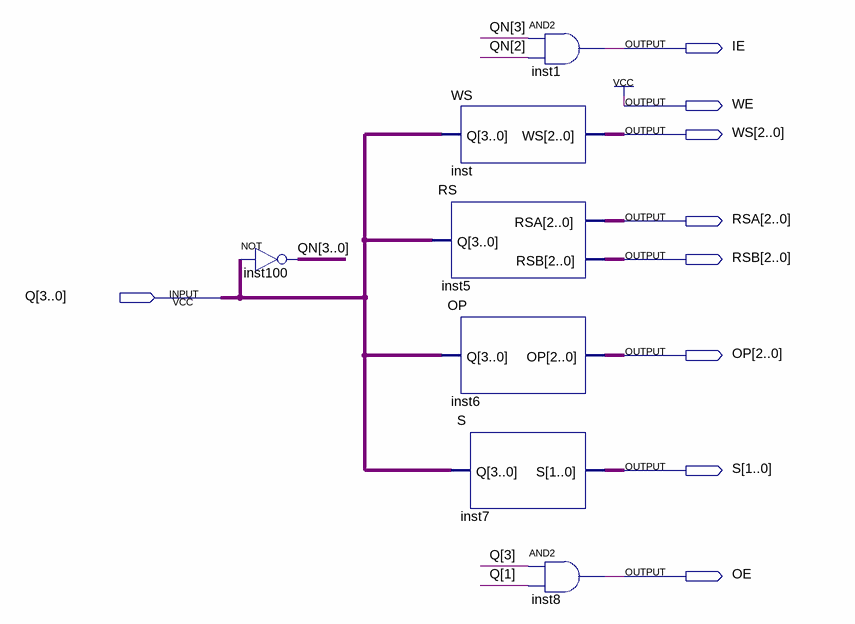
[diagram p0: schematic sheet]
// Quartus schematic OUTPUTLOGIC.bdf as structural Verilog: 7 symbols, 9 pins
module OUTPUTLOGIC (
  input  [3:0] Q,
  output IE,
  output WE,
  output [2:0] WS,
  output [2:0] RSA,
  output [2:0] RSB,
  output [2:0] OP,
  output [1:0] S,
  output OE
);

  wire [3:0] QN;

  assign QN = ~Q;  // NOT inst100, 4 bits wide
  WS inst (.Q(Q), .WS(WS));
  RS inst5 (.Q(Q), .RSA(RSA), .RSB(RSB));
  OP inst6 (.Q(Q), .OP(OP));
  S inst7 (.Q(Q), .S(S));
  and inst1 (IE, QN[3], QN[2]);
  and inst8 (OE, Q[3], Q[1]);

  assign WE = 1'b1;
endmodule
